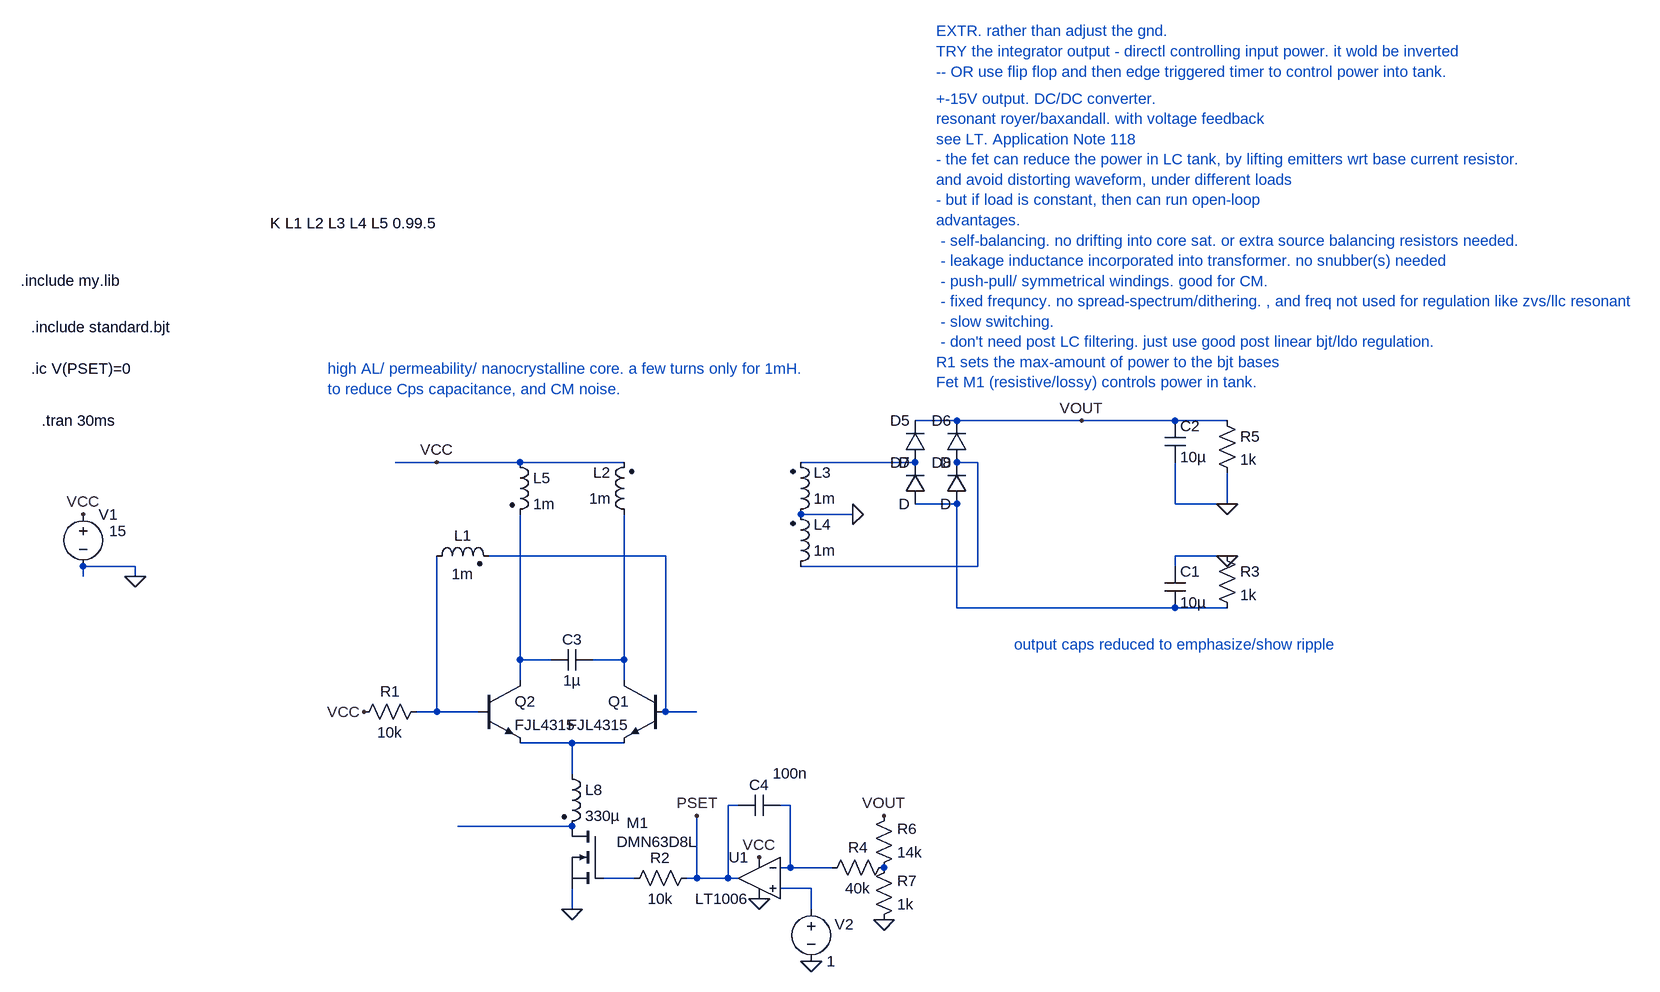
[diagram p0: schematic Draft14.asc]
Draft14.asc, the LTspice schematic file:
Version 4
SHEET 1 5720 1740
WIRE 2176 -192 2112 -192
WIRE 2368 -192 2176 -192
WIRE 2512 -192 2368 -192
WIRE 2592 -192 2512 -192
WIRE 1376 -128 1312 -128
WIRE 1504 -128 1376 -128
WIRE 1664 -128 1504 -128
WIRE 2112 -128 1936 -128
WIRE 2208 -128 2176 -128
WIRE 2176 -64 2112 -64
WIRE 2512 -64 2512 -128
WIRE 2592 -64 2592 -112
WIRE 2592 -64 2512 -64
WIRE 2016 -48 1936 -48
WIRE 1728 16 1456 16
WIRE 2592 16 2512 16
WIRE 912 32 832 32
WIRE 2208 32 2208 -128
WIRE 2208 32 1936 32
WIRE 2512 32 2512 16
WIRE 832 48 832 32
WIRE 912 48 912 32
WIRE 2176 96 2176 -64
WIRE 2512 96 2176 96
WIRE 2592 96 2512 96
WIRE 1504 176 1504 -48
WIRE 1552 176 1504 176
WIRE 1664 176 1664 -48
WIRE 1664 176 1616 176
WIRE 1504 208 1504 176
WIRE 1664 208 1664 176
WIRE 1376 256 1376 16
WIRE 1376 256 1344 256
WIRE 1440 256 1376 256
WIRE 1728 256 1728 16
WIRE 1776 256 1728 256
WIRE 1584 304 1504 304
WIRE 1664 304 1584 304
WIRE 1584 352 1584 304
WIRE 1840 400 1824 400
WIRE 1920 400 1904 400
WIRE 1584 432 1408 432
WIRE 1920 496 1920 400
WIRE 1920 496 1904 496
WIRE 1984 496 1920 496
WIRE 1680 512 1632 512
WIRE 1776 512 1776 416
WIRE 1776 512 1760 512
WIRE 1824 512 1824 400
WIRE 1824 512 1776 512
WIRE 1840 512 1824 512
WIRE 1952 528 1904 528
WIRE 1584 560 1584 528
WIRE 1952 560 1952 528
FLAG 2592 -64 0
FLAG 2016 -48 0
FLAG 2592 16 0
FLAG 912 48 0
FLAG 832 -48 VCC
FLAG 1376 -128 VCC
FLAG 1264 256 VCC
FLAG 1584 560 0
FLAG 1872 480 VCC
FLAG 1872 544 0
FLAG 1952 640 0
FLAG 2064 576 0
FLAG 2368 -192 VOUT
FLAG 2064 416 VOUT
FLAG 1776 416 PSET
SYMBOL ind2 1920 -32 M180
WINDOW 0 36 80 Left 2
WINDOW 3 36 40 Left 2
SYMATTR InstName L3
SYMATTR Value 1m
SYMATTR Type ind
SYMBOL ind2 1680 -32 R180
WINDOW 0 36 80 Left 2
WINDOW 3 36 40 Left 2
SYMATTR InstName L2
SYMATTR Value 1m
SYMATTR Type ind
SYMBOL diode 2128 -128 R180
WINDOW 0 24 64 Left 2
WINDOW 3 24 0 Left 2
SYMATTR InstName D5
SYMBOL diode 2192 -128 R180
WINDOW 0 24 64 Left 2
WINDOW 3 24 0 Left 2
SYMATTR InstName D6
SYMBOL diode 2128 -64 R180
WINDOW 0 24 64 Left 2
WINDOW 3 24 0 Left 2
SYMATTR InstName D7
SYMBOL diode 2192 -64 R180
WINDOW 0 24 64 Left 2
WINDOW 3 24 0 Left 2
SYMATTR InstName D8
SYMBOL cap 2496 -192 R0
SYMATTR InstName C2
SYMATTR Value 10µ
SYMBOL res 2576 -208 R0
SYMATTR InstName R5
SYMATTR Value 1k
SYMBOL ind2 1920 48 M180
WINDOW 0 36 80 Left 2
WINDOW 3 36 40 Left 2
SYMATTR InstName L4
SYMATTR Value 1m
SYMATTR Type ind
SYMBOL cap 2496 32 R0
SYMATTR InstName C1
SYMATTR Value 10µ
SYMBOL res 2576 0 R0
SYMATTR InstName R3
SYMATTR Value 1k
SYMBOL voltage 832 -64 R0
WINDOW 123 0 0 Left 0
WINDOW 39 0 0 Left 0
WINDOW 3 40 42 Left 2
SYMATTR Value 15
SYMATTR InstName V1
SYMBOL ind2 1360 32 R270
WINDOW 0 32 56 VTop 2
WINDOW 3 4 56 VBottom 2
SYMATTR InstName L1
SYMATTR Value 1m
SYMATTR Type ind
SYMBOL ind2 1488 -144 R0
SYMATTR InstName L5
SYMATTR Value 1m
SYMATTR Type ind
SYMBOL ind2 1568 336 R0
SYMATTR InstName L8
SYMATTR Value 330µ
SYMATTR Type ind
SYMBOL cap 1616 160 R90
WINDOW 0 0 32 VBottom 2
WINDOW 3 32 32 VTop 2
SYMATTR InstName C3
SYMATTR Value 1µ
SYMBOL res 1360 240 R90
WINDOW 0 0 56 VBottom 2
WINDOW 3 32 56 VTop 2
SYMATTR InstName R1
SYMATTR Value 10k
SYMBOL npn 1440 208 R0
SYMATTR InstName Q2
SYMATTR Value FJL4315
SYMBOL npn 1728 208 M0
SYMATTR InstName Q1
SYMATTR Value FJL4315
SYMBOL nmos 1632 432 M0
WINDOW 0 -70 -5 Left 2
WINDOW 3 -147 24 Left 2
SYMATTR InstName M1
SYMATTR Value DMN63D8L
SYMATTR Prefix X
SYMBOL OpAmps\\LT1006 1872 448 M0
SYMATTR InstName U1
SYMBOL cap 1904 384 R90
WINDOW 0 0 32 VBottom 2
WINDOW 3 -49 -16 VTop 2
SYMATTR InstName C4
SYMATTR Value 100n
SYMBOL res 1776 496 R90
WINDOW 0 0 56 VBottom 2
WINDOW 3 32 56 VTop 2
SYMATTR InstName R2
SYMATTR Value 10k
SYMBOL res 2080 480 R90
WINDOW 0 0 56 VBottom 2
WINDOW 3 32 56 VTop 2
SYMATTR InstName R4
SYMATTR Value 40k
SYMBOL res 2048 512 M180
WINDOW 0 36 76 Left 2
WINDOW 3 36 40 Left 2
SYMATTR InstName R6
SYMATTR Value 14k
SYMBOL res 2048 592 M180
WINDOW 0 36 76 Left 2
WINDOW 3 36 40 Left 2
SYMATTR InstName R7
SYMATTR Value 1k
SYMBOL voltage 1952 544 R0
WINDOW 123 0 0 Left 0
WINDOW 39 0 0 Left 0
WINDOW 0 36 39 Left 2
SYMATTR InstName V2
SYMATTR Value 1
TEXT 768 -192 Left 2 !.tran 30ms
TEXT 1120 -496 Left 2 !K L1 L2 L3 L4 L5 0.99.5
TEXT 752 -336 Left 2 !.include standard.bjt
TEXT 736 -408 Left 2 !.include my.lib
TEXT 2264 152 Left 2 ;output caps reduced to emphasize/show ripple
TEXT 2144 -688 Left 2 ;+-15V output. DC/DC converter.\nresonant royer/baxandall. with voltage feedback\nsee LT. Application Note 118\n- the fet can reduce the power in LC tank, by lifting emitters wrt base current resistor.\nand avoid distorting waveform, under different loads\n- but if load is constant, then can run open-loop\nadvantages.\n - self-balancing. no drifting into core sat. or extra source balancing resistors needed.\n - leakage inductance incorporated into transformer. no snubber(s) needed\n - push-pull/ symmetrical windings. good for CM.\n - fixed frequncy. no spread-spectrum/dithering. , and freq not used for regulation like zvs/llc resonant\n - slow switching.\n - don't need post LC filtering. just use good post linear bjt/ldo regulation.\nR1 sets the max-amount of power to the bjt bases\nFet M1 (resistive/lossy) controls power in tank.
TEXT 752 -272 Left 2 !.ic V(PSET)=0
TEXT 2144 -792 Left 2 ;EXTR. rather than adjust the gnd.\nTRY the integrator output - directl controlling input power. it wold be inverted\n-- OR use flip flop and then edge triggered timer to control power into tank.
TEXT 1208 -272 Left 2 ;high AL/ permeability/ nanocrystalline core. a few turns only for 1mH.\nto reduce Cps capacitance, and CM noise.

The netlist it stands for:
* Draft14.asc
L3 0 N001 1m
L2 N006 VCC 1m
D5 N001 VOUT D
D6 N002 VOUT D
D7 N003 N001 D
D8 N003 N002 D
C2 VOUT 0 10µ
R5 VOUT 0 1k
L4 N002 0 1m
C1 0 N003 10µ
R3 0 N003 1k
V1 VCC 0 15
L1 N007 N004 1m
L5 VCC N005 1m
L8 N008 N010 330µ
C3 N006 N005 1µ
R1 N007 VCC 10k
Q2 N005 N007 N008 0 FJL4315
Q1 N006 N004 N008 0 FJL4315
XM1 N010 N011 0 DMN63D8L  ; pins D G S
XU1 N012 N009 VCC 0 PSET LT1006  ; pins In+ In- V+ V- OUT
C4 N009 PSET 100n
R2 PSET N011 10k
R4 P001 N009 40k
R6 P001 VOUT 14k
R7 0 P001 1k
V2 N012 0 1
.model D D
.lib standard.dio
.model NPN NPN
.model PNP PNP
.lib standard.bjt
.tran 30ms
K L1 L2 L3 L4 L5 0.99.5
.include standard.bjt
.include my.lib
* output caps reduced to emphasize/show ripple
* +-15V output. DC/DC converter.
* resonant royer/baxandall. with voltage feedback
* see LT. Application Note 118
* - the fet can reduce the power in LC tank, by lifting emitters wrt base current resistor.
* and avoid distorting waveform, under different loads
* - but if load is constant, then can run open-loop
* advantages.
*  - self-balancing. no drifting into core sat. or extra source balancing resistors needed.
*  - leakage inductance incorporated into transformer. no snubber(s) needed
*  - push-pull/ symmetrical windings. good for CM.
*  - fixed frequncy. no spread-spectrum/dithering. , and freq not used for regulation like zvs/llc resonant
*  - slow switching.
*  - don't need post LC filtering. just use good post linear bjt/ldo regulation.
* R1 sets the max-amount of power to the bjt bases
* Fet M1 (resistive/lossy) controls power in tank.
.ic V(PSET)=0
* EXTR. rather than adjust the gnd.
* TRY the integrator output - directl controlling input power. it wold be inverted
* -- OR use flip flop and then edge triggered timer to control power into tank.
* high AL/ permeability/ nanocrystalline core. a few turns only for 1mH.
* to reduce Cps capacitance, and CM noise.
.lib LTC.lib
.backanno
.end